# Altium schematic sheet RAIL_DISCHARGE.SchDoc
size A4; SheetNumber: 9; SheetTotal: 10
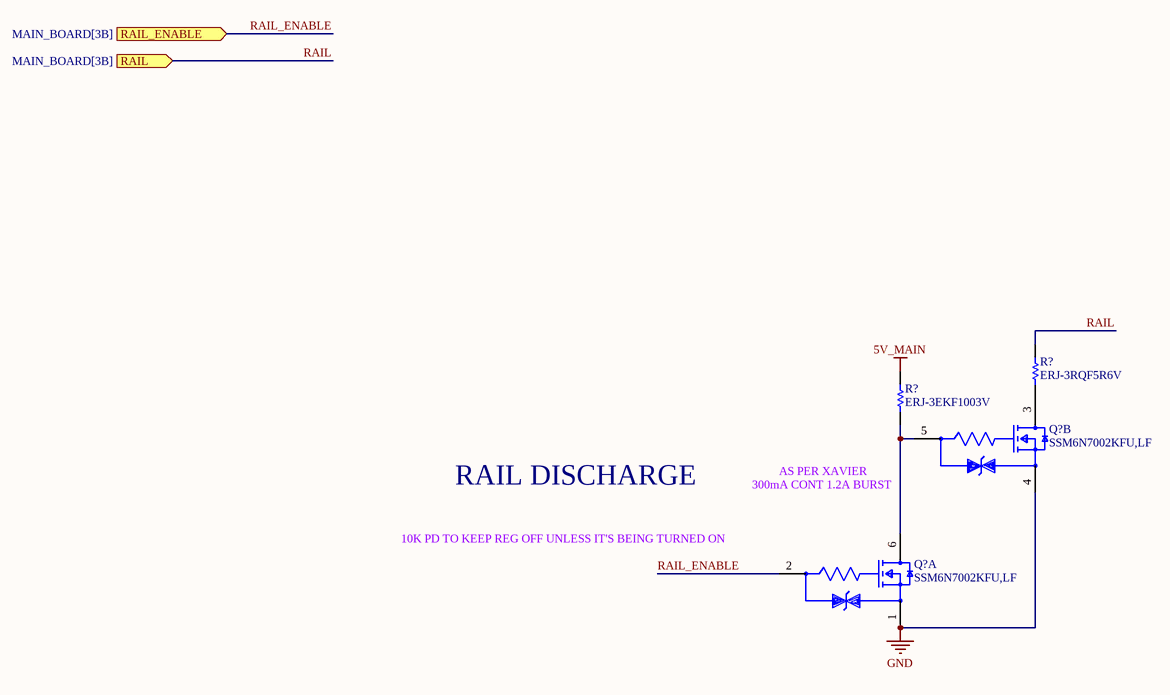
[diagram p0: RAIL_DISCHARGE.SchDoc]

## Parts
(Parts that share a designator on the sheet are numbered #1, #2 ... from top to bottom, then left to right.)
Q?#1  SSM6N7002KFU,LF  [FP-SSOP6-P-0_65A-MFG]  (part B of 2)
Q?#2  SSM6N7002KFU,LF  [FP-SSOP6-P-0_65A-MFG]  (part A of 2)
R?#1  ERJ-3RQF5R6V  [RESC1608X55X30LL15T15]
R?#2  ERJ-3EKF1003V  [RESC1608X55X30ML15T15]

## Ports
RAIL (in, see MAIN_BOARD[3B]), RAIL_ENABLE (in, see MAIN_BOARD[3B])

## Nets
5V_MAIN: R?#2.2
GND: Q?#1.4(Source2) Q?#2.1(Source1)
RAIL: R?#1.2 ; port RAIL
RAIL_ENABLE: Q?#2.2(Gate1) ; port RAIL_ENABLE
NetQ?#1_3: Q?#1.3(Drain2) R?#1.1
NetQ?#1_5: Q?#1.5(Gate2) Q?#2.6(Drain1) R?#2.1

## Notes on the sheet
- RAIL DISCHARGE
- 300mA CONT 1.2A BURST
- AS PER XAVIER
- 10K PD TO KEEP REG OFF UNLESS IT'S BEING TURNED ON

## Library data of the parts
Q?#1 Q?#2 = CMP-35916-000009-1: MOSFET 2N-CH 60V 0.3A; Input Capacitance: 40pF; Continuous Drain Current (ID): 300mA; Max Power Dissipation: 285mW; FET Type: 2 N-Channel; Rds On Max: 1.5R; Mount: Surface Mount; Drain to Source Voltage (Vdss): 60V; Packaging: Tape and Reel
R?#1 = CMP-2000-00850-1: Manufacturer: Panasonic; Part Number: ERJ-3RQF5R6V
R?#2 = CMP-2000-00182-1: Manufacturer: Panasonic; Part Number: ERJ-3EKF1003V